# Altium schematic sheet config-bank0.SchDoc: Config FPGA - Bank 0
size Letter; CompanyName: Brinton Engineering, LLC; Address1: 3479 Edison Way; Address2: Menlo Park CA 94025; Address3: +1 (877) 778-8435; Address4: brintonengineering.com; Revision: 1; SheetNumber: 1; SheetTotal: 1
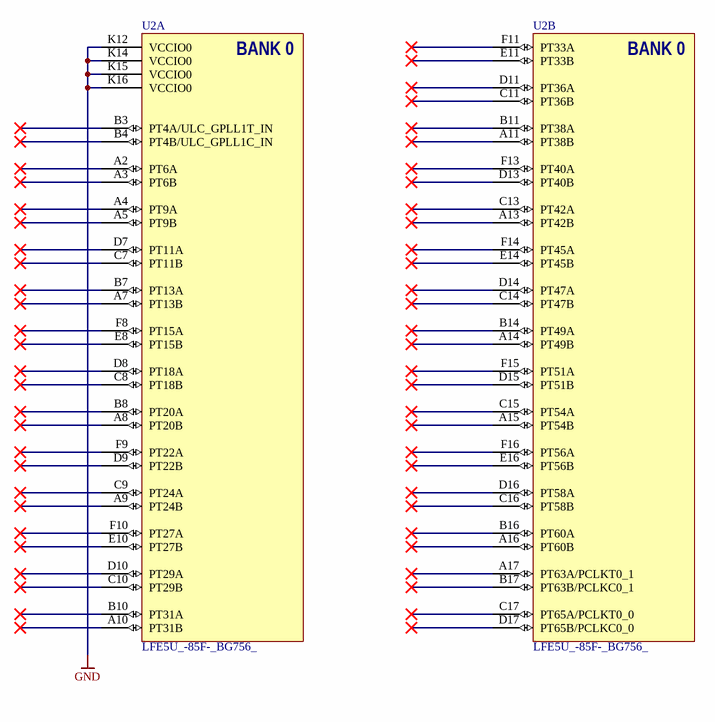
[diagram p0: config-bank0.SchDoc]

## Parts
U2  LFE5U_-85F-_BG756_  [caBGA756]  (parts A,B of 19)

## Nets
GND: U2.K12(VCCIO0) U2.K14(VCCIO0) U2.K15(VCCIO0) U2.K16(VCCIO0)

Not connected (* = marked no-connect by the designer): U2 A2(PT6A)* A3(PT6B)* A4(PT9A)* A5(PT9B)* A7(PT13B)* A8(PT20B)* A9(PT24B)* A10(PT31B)* A11(PT38B)* A13(PT42B)* A14(PT49B)* A15(PT54B)* A16(PT60B)* A17(PT63A/PCLKT0_1)* B3(PT4A/ULC_GPLL1T_IN)* B4(PT4B/ULC_GPLL1C_IN)* B7(PT13A)* B8(PT20A)* B10(PT31A)* B11(PT38A)* B14(PT49A)* B16(PT60A)* B17(PT63B/PCLKC0_1)* C7(PT11B)* C8(PT18B)* C9(PT24A)* C10(PT29B)* C11(PT36B)* C13(PT42A)* C14(PT47B)* C15(PT54A)* C16(PT58B)* C17(PT65A/PCLKT0_0)* D7(PT11A)* D8(PT18A)* D9(PT22B)* D10(PT29A)* D11(PT36A)* D13(PT40B)* D14(PT47A)* D15(PT51B)* D16(PT58A)* D17(PT65B/PCLKC0_0)* E8(PT15B)* E10(PT27B)* E11(PT33B)* E14(PT45B)* E16(PT56B)* F8(PT15A)* F9(PT22A)* F10(PT27A)* F11(PT33A)* F13(PT40A)* F14(PT45A)* F15(PT51A)* F16(PT56A)*

## Notes on the sheet
- Title
- Engineer
- Revision
- Drawn By
- Checked By
- Date
- Sheet
- of
- (in symbol LFE5U_-85F-_BG756_, part A) BANK 0
- (in symbol LFE5U_-85F-_BG756_, part B) BANK 0

## Library data of the parts
U2 = LFE5U_-85F-_BG756_: ECP5 FPGA, 85k LUT, 756-caBGA; Manufacturer: Lattice Semiconductor; Manufacturer P/N: LFE5U_-85F-_BG756_